# Altium schematic sheet Receive.SchDoc
size A3; SheetNumber: 1; SheetTotal: 1
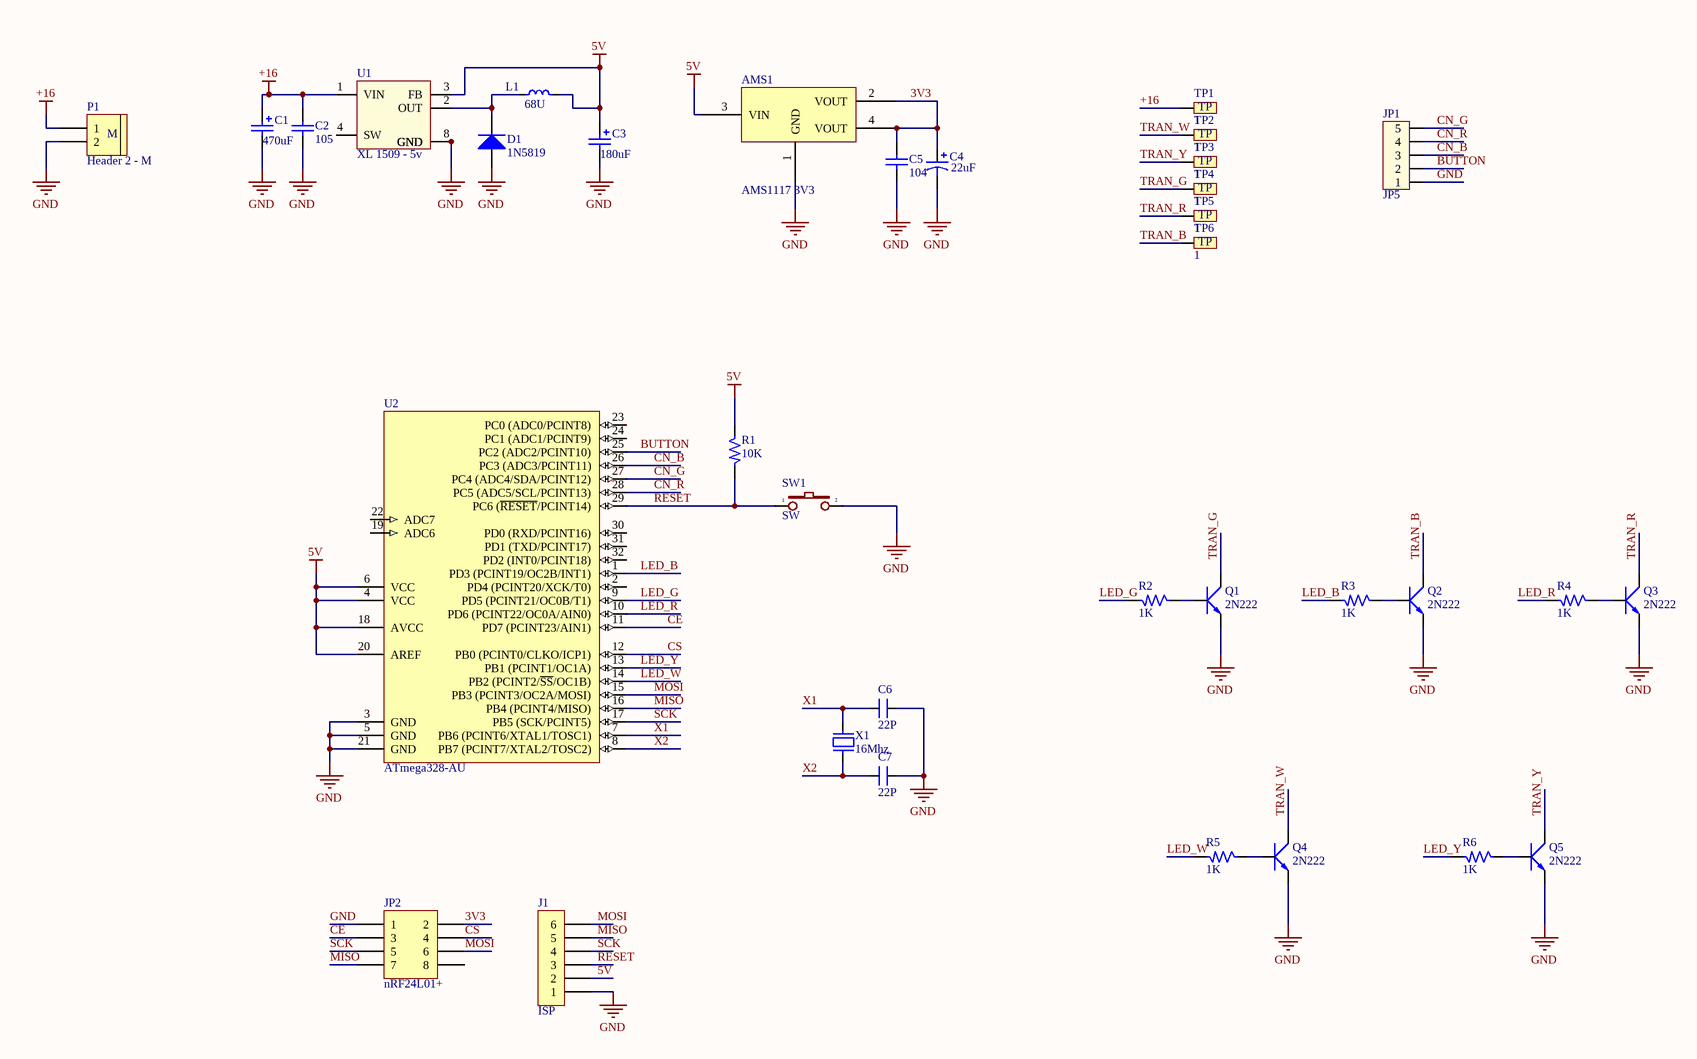
[diagram p0: Receive.SchDoc]

## Parts
AMS1  AMS1117 3V3  [SOT223-4N]
C1  value 470uF  [CP2/5]
C2  105  [CN-SMD-0805]
C3  value 180uF  [CP2/5]
C4  22uF  [C5mm]
C5  104  [CN-SMD-0805]
C6  22P  [CN-SMD-0805]
C7  22P  [CN-SMD-0805]
D1  1N5819  [SS14]
J1  ISP  [Header6]
JP1  JP5  [XH2.54-5P]
JP2  nRF24L01+  [HDR2X4]
L1  68U  [CD75]
P1  Header 2 - M  [Medium - Header 2]
Q1  2N222  [SOT23-231]
Q2  2N222  [SOT23-231]
Q3  2N222  [SOT23-231]
Q4  2N222  [SOT23-231]
Q5  2N222  [SOT23-231]
R1  10K  [RES-SMD-0805]
R2  1K  [RES-SMD-0805]
R3  1K  [RES-SMD-0805]
R4  1K  [RES-SMD-0805]
R5  1K  [RES-SMD-0805]
R6  1K  [RES-SMD-0805]
SW1  SW  [SW2]
TP1  1  [TP]
TP2  1  [TP]
TP3  1  [TP]
TP4  1  [TP]
TP5  1  [TP]
TP6  1  [TP]
U1  XL 1509 - 5v  [XL1509 - SOIC 8]
U2  ATmega328-AU  [TQFP32]
X1  16Mhz  [XT2]

## Nets
5V: AMS1.3(VIN) C3.1 J1.2 L1.2 R1.1 U1.3(FB) U2.4(VCC) U2.6(VCC) U2.18(AVCC) U2.20(AREF)
+16: C1.1 C2.2 P1.1 TP1.TP1 U1.1(VIN)
GND: AMS1.1(GND) C1.2 C2.1 C3.2 C4.2 C5.1 C6.1 C7.1 D1.1(Anot) J1.1 JP1.1 JP2.1 P1.2 Q1.1(E) Q2.1(E) Q3.1(E) Q4.1(E) Q5.1(E) SW1.2 U1.5(GND) U1.6(GND) U1.7(GND) U1.8(GND) U2.3(GND) U2.5(GND) U2.21(GND)
3V3: AMS1.2(VOUT) AMS1.4(VOUT) C4.1 C5.2 JP2.2
BUTTON: JP1.2 U2.25(PC2_(ADC2/PCINT10))
CE: JP2.3 U2.11(PD7_(PCINT23/AIN1))
CN_B: JP1.3 U2.26(PC3_(ADC3/PCINT11))
CN_G: JP1.5 U2.27(PC4_(ADC4/SDA/PCINT12))
CN_R: JP1.4 U2.28(PC5_(ADC5/SCL/PCINT13))
CS: JP2.4 U2.12(PB0_(PCINT0/CLKO/ICP1))
LED_B: R3.2 U2.1(PD3_(PCINT19/OC2B/INT1))
LED_G: R2.2 U2.9(PD5_(PCINT21/OC0B/T1))
LED_R: R4.2 U2.10(PD6_(PCINT22/OC0A/AIN0))
LED_W: R5.2 U2.14(PB2_(PCINT2/~{SS}/OC1B))
LED_Y: R6.2 U2.13(PB1_(PCINT1/OC1A))
MISO: J1.5 JP2.7 U2.16(PB4_(PCINT4/MISO))
MOSI: J1.6 JP2.6 U2.15(PB3_(PCINT3/OC2A/MOSI))
RESET: J1.3 R1.2 SW1.1 U2.29(PC6_(~{RESET}/PCINT14))
SCK: J1.4 JP2.5 U2.17(PB5_(SCK/PCINT5))
TRAN_B: Q2.3(C) TP6.TP1
TRAN_G: Q1.3(C) TP4.TP1
TRAN_R: Q3.3(C) TP5.TP1
TRAN_W: Q4.3(C) TP2.TP1
TRAN_Y: Q5.3(C) TP3.TP1
X1: C6.2 U2.7(PB6_(PCINT6/XTAL1/TOSC1)) X1.2
X2: C7.2 U2.8(PB7_(PCINT7/XTAL2/TOSC2)) X1.1
NetD1_2: D1.2(Katot) L1.1 U1.2(OUT)
NetQ1_2: Q1.2(B) R2.1
NetQ2_2: Q2.2(B) R3.1
NetQ3_2: Q3.2(B) R4.1
NetQ4_2: Q4.2(B) R5.1
NetQ5_2: Q5.2(B) R6.1

Not connected (* = marked no-connect by the designer): JP2 8; U1 4(SW); U2 2(PD4_(PCINT20/XCK/T0)) 19(ADC6) 22(ADC7) 23(PC0_(ADC0/PCINT8)) 24(PC1_(ADC1/PCINT9)) 30(PD0_(RXD/PCINT16)) 31(PD1_(TXD/PCINT17)) 32(PD2_(INT0/PCINT18))

## Notes on the sheet
- (in symbol Header 2 - M) M

## Library data of the parts
AMS1 = AMS1117: AMS
C1 C3 = Cap Pol3: Polarized Capacitor (Surface Mount); VALUE: C?; LatestRevisionDate: 17-Jul-2002; LatestRevisionNote: Re-released for DXP Platform.; PackageReference: C0805; Publisher: Altium Limited
C2 C5 = CAP 33P_0805
C4 = Cap Pol 5mm: Polarized Capacitor (Axial); Published: 8-Jun-2000; LatestRevisionDate: 17-Jul-2002; LatestRevisionNote: Re-released for DXP Platform.; PackageReference: POLAR0.8; Publisher: Altium Limited
C6 C7 = CN1: Cap np  1pF - 472pF; Value: 100pF
J1 = JUMP 6: JUMP DON DUC 2.54
JP1 = Header 5P: Connector 5; Value: Connector 5
JP2 = JUMP DOI-4: JUMP DOI DUC; LatestRevisionDate: 17-Jul-2002; LatestRevisionNote: Re-released for DXP Platform.; Publisher: Altium Limited
L1 = L100uH3A: Cuon cam
P1 = Header 2 - M: Header, 2-Pin, Medium; LatestRevisionDate: 17-Jul-2002; LatestRevisionNote: Re-released for DXP Platform.; Publisher: Altium Limited
Q1-Q5 = NPN_EBC: P 600mW, EBC; Value: C9014
R1-R6 = RES 1/4W: Tro 1/4W; Value: R1/4W - 1K
SW1 = SW2: Switch button 2 pin; Value: SW chip 2 pin
TP1-TP6 = TP: CONNECT 1
U1 = XL 1509 - 5v: IC HA AP 5V
U2 = ATmega328-AU: 8-bit AVR Microcontroller, 32KB Flash, 1KB EEPROM, 2KB SRAM, 32-pin TQFP, Industrial Grade (-40°C to 85°C); Published: 1-Apr-2010; DatasheetVersion: revA, Jan-2010; PackageVersion: revB, Oct-2001; PackageReference: 32A; Publisher: Altium Limited; PackageDescription: 32-Lead, 7x7x1.0 mm Body, 0.8mm Lead Pitch, Thin Profile Plastic Quad Flat Package (TQFP); Supplier 1: Digi-Key; Supplier Part Number 1: ATMEGA328-AU-ND; Supplier 2: Mouser; Supplier Part Number 2: 556-ATMEGA328-AU; Code_JEDEC: MS-026-ABA; ComponentLink1Description: Manufacturer Link; ComponentLink1URL: http://www.atmel.com/products/avr/default.asp?; ComponentLink2Description: ATmega48A/48PA/88A/88PA/168A/168PA/328/328P Datasheet; ComponentLink2URL: http://www.atmel.com/dyn/resources/prod_documents/8271.pdf; ComponentLink3Description: ATmega48A/48PA/88A/88PA/168A/168PA/328/328P Summary; ComponentLink3URL: http://www.atmel.com/dyn/resources/prod_documents/8271S.pdf; ComponentLink4Description: Atmel.com Home; ComponentLink4URL: http://www.atmel.com
X1 = XT2: Crystal For all Crystal 2pin.; Value: 4Mhz